# Altium schematic sheet PCIE - mini-pcie-connector.SchDoc
size A4
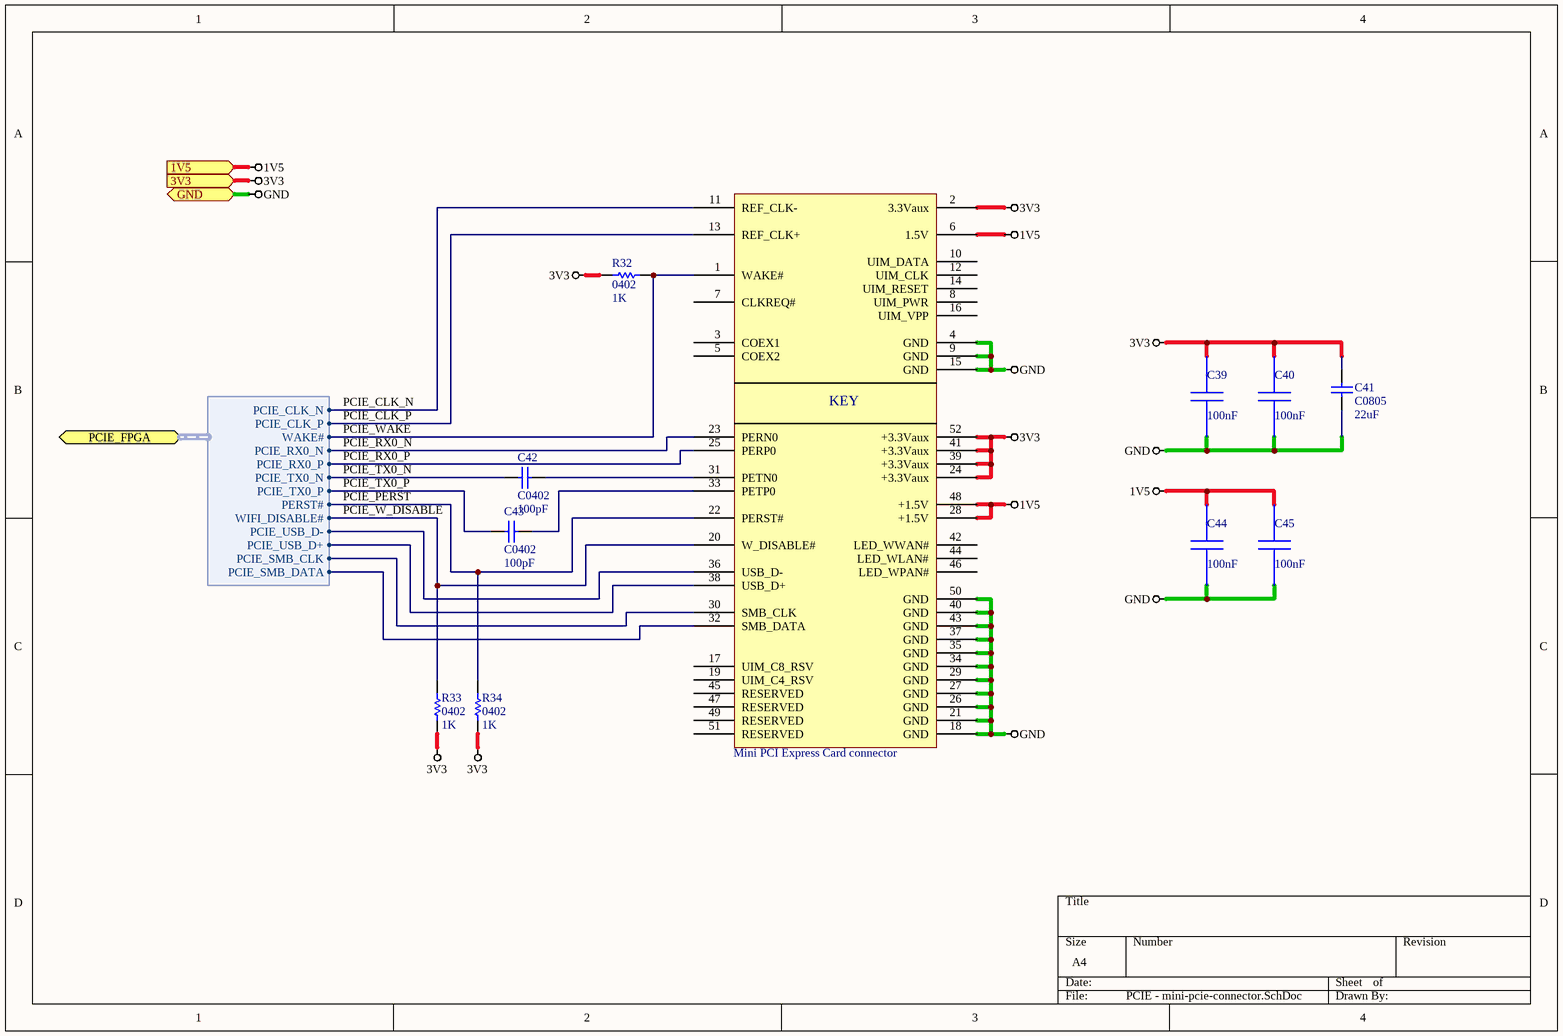
[diagram p0: PCIE - mini-pcie-connector.SchDoc]

## Parts
C39  value 100nF  [C-0603]  (hidden comment: C0603C104K3RACTU)
C40  value 100nF  [C-0603]  (hidden comment: C0603C104K3RACTU)
C41  C0805  value 22uF  [C-0805]
C42  C0402  value 100pF  [CAPC0402(1005)60_L]
C43  C0402  value 100pF  [CAPC0402(1005)60_L]
C44  value 100nF  [C-0603]  (hidden comment: C0603C104K3RACTU)
C45  value 100nF  [C-0603]  (hidden comment: C0603C104K3RACTU)
CN1  Mini PCI Express Card connector  [Mini PCI Express]  (no BOM)
R32  0402  value 1K  [RESC0402(1005)40_L]
R33  0402  value 1K  [RESC0402(1005)40_L]
R34  0402  value 1K  [RESC0402(1005)40_L]

## Ports
1V5 (in), 3V3 (in), GND, PCIE_FPGA (harness PCIE_FPGA)

## Harnesses
PCIE_FPGA: PCIE_CLK_N, PCIE_CLK_P, PCIE_RX0_N, PCIE_RX0_P, PCIE_TX0_N, PCIE_TX0_P, PERST#, WIFI_DISABLE#, PCIE_USB_D-, PCIE_USB_D+, PCIE_SMB_CLK, PCIE_SMB_DATA, WAKE#

## Nets
1V5: C44.1 C45.1 CN1.6(1.5V) CN1.28(+1.5V) CN1.48(+1.5V) ; port 1V5
3V3: C39.1 C40.1 C41.2 CN1.2(3.3Vaux) CN1.24(+3.3Vaux) CN1.39(+3.3Vaux) CN1.41(+3.3Vaux) CN1.52(+3.3Vaux) R32.1 R33.1 R34.1 ; port 3V3
GND: C39.2 C40.2 C41.1 C44.2 C45.2 CN1.4(GND) CN1.9(GND) CN1.15(GND) CN1.18(GND) CN1.21(GND) CN1.26(GND) CN1.27(GND) CN1.29(GND) CN1.34(GND) CN1.35(GND) CN1.37(GND) CN1.40(GND) CN1.43(GND) CN1.50(GND) ; port GND
PCIE_CLK_N: CN1.11(REF_CLK-) ; port PCIE_FPGA.PCIE_CLK_N
PCIE_CLK_P: CN1.13(REF_CLK+) ; port PCIE_FPGA.PCIE_CLK_P
PCIE_PERST: CN1.22(PERST#) R34.2 ; port PCIE_FPGA.PERST#
PCIE_RX0_N: CN1.23(PERN0) ; port PCIE_FPGA.PCIE_RX0_N
PCIE_RX0_P: CN1.25(PERP0) ; port PCIE_FPGA.PCIE_RX0_P
PCIE_TX0_N: C42.1 ; port PCIE_FPGA.PCIE_TX0_N
PCIE_TX0_P: C43.1 ; port PCIE_FPGA.PCIE_TX0_P
PCIE_W_DISABLE: CN1.20(W_DISABLE#) R33.2 ; port PCIE_FPGA.WIFI_DISABLE#
PCIE_WAKE: CN1.1(WAKE#) R32.2 ; port PCIE_FPGA.WAKE#
NetC42_2: C42.2 CN1.31(PETN0)
NetC43_2: C43.2 CN1.33(PETP0)
NetCN1_30: CN1.30(SMB_CLK) ; port PCIE_FPGA.PCIE_SMB_CLK
NetCN1_32: CN1.32(SMB_DATA) ; port PCIE_FPGA.PCIE_SMB_DATA
NetCN1_36: CN1.36(USB_D-) ; port PCIE_FPGA.PCIE_USB_D-
NetCN1_38: CN1.38(USB_D+) ; port PCIE_FPGA.PCIE_USB_D+

Not connected (* = marked no-connect by the designer): CN1 3(COEX1) 5(COEX2) 7(CLKREQ#) 8(UIM_PWR) 10(UIM_DATA) 12(UIM_CLK) 14(UIM_RESET) 16(UIM_VPP) 17(UIM_C8_RSV) 19(UIM_C4_RSV) 42(LED_WWAN#) 44(LED_WLAN#) 45(RESERVED) 46(LED_WPAN#) 47(RESERVED) 49(RESERVED) 51(RESERVED)

## Notes on the sheet
- (in symbol MiniPCIe Card) KEY

## Library data of the parts
C39 C40 C44 C45 = C0603C104K3RACTU: Manufacturer Name: Kemet; PackageReference: C0603C104K3RACTU; Manufacturer Part Number: C0603C104K3RACTU
C41 = C0805: Ceramic Chip Capacitor - Standard; Note: Footprint corresponds to dimensions for bulk cassette packaging. This case size has tightened tolerances.; Published: 17-Jul-2002; LatestRevisionDate: 19-Mar-2004; LatestRevisionNote: Silkscreen size reduced.; DatasheetDocument: Mar-2001; PackageDocument: Mar-2001; PackageReference: 0805; Publisher: Altium Limited; Code_JEITA: 0805; Code_IPC: 2012[0805]; ComponentLink1Description: Manufacturer Link; ComponentLink1URL: http://www.kemet.com/; ComponentLink2Description: Datasheet; ComponentLink2URL: http://www.kemet.com/kemet/web/homepage/kechome.nsf/vapubfilesname/F3102TA.pdf/$file/F3102TA.pdf
C42 C43 = C0402: Ceramic Chip Capacitor - Standard; Note: Footprint corresponds to dimensions for bulk cassette packaging. This case size has tightened tolerances.; Published: 17-Jul-2002; LatestRevisionDate: 19-Mar-2004; LatestRevisionNote: Silkscreen size reduced.; DatasheetDocument: Mar-2001; PackageDocument: Mar-2001; PackageReference: 0402; Publisher: Altium Limited; Code_JEITA: 0402; Code_IPC: 1005 [0402]; ComponentLink1Description: Manufacturer Link; ComponentLink1URL: http://www.kemet.com/; ComponentLink2Description: Datasheet; ComponentLink2URL: http://www.kemet.com/kemet/web/homepage/kechome.nsf/vapubfilesname/F3102TA.pdf/$file/F3102TA.pdf
CN1 = MiniPCIe Card
R32-R34 = Res1: Resistor; Published: 8-Jun-2000; LatestRevisionDate: 17-Jul-2002; LatestRevisionNote: Re-released for DXP Platform.; PackageReference: AXIAL-0.3; Publisher: Altium Limited; PackageDescription: Axial Device, Thru-Hole; 2 Leads; 0.3 in Pin Spacing